# Altium schematic sheet Fuente3.3VDC.SchDoc
size A4; SheetNumber: 4; SheetTotal: 10
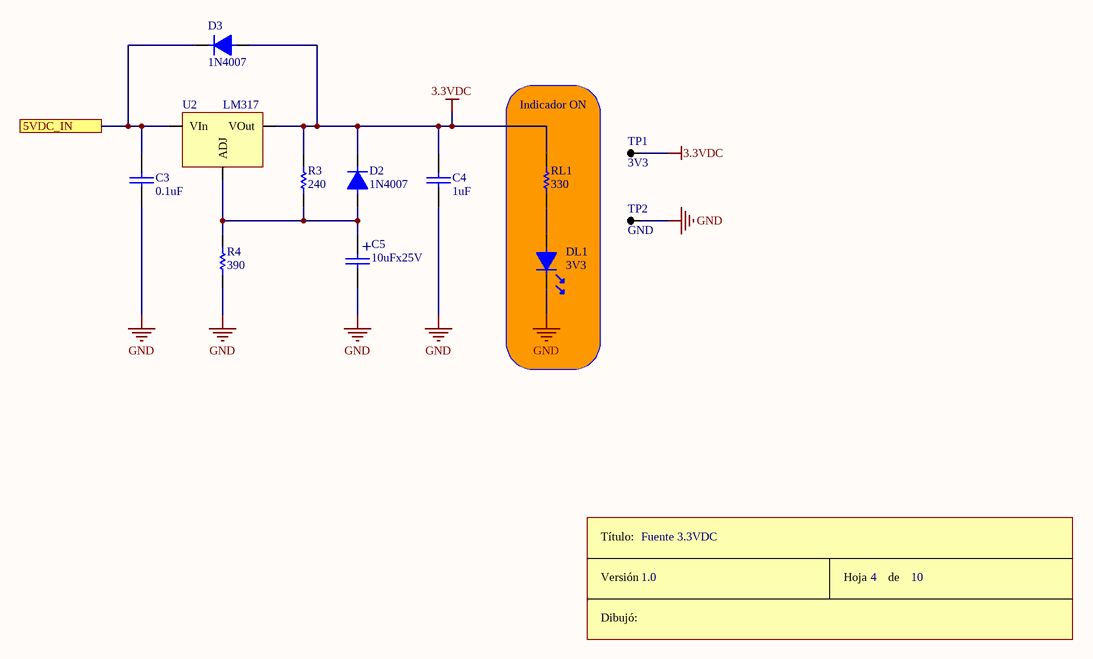
[diagram p0: Fuente3.3VDC.SchDoc]

## Parts
C3  0.1uF  [CAP100]
C4  1uF  [CAP200]
C5  10uFx25V  [CAP100RP]
D2  1N4007  [DO41]
D3  1N4007  [DO41]
DL1  3V3  [LED3]
R3  240  [RES400]
R4  390  [RES400]
RL1  330  [RES300]
ROT2  Rótulo  (value not drawn)  (graphical)
TP1  3V3  [TPTH]
TP2  GND  [TPTH]
U2  LM317  [TO-220 H]

## Blocks framed on the sheet
Indicador ON: DL1 RL1

## Ports
5VDC_IN

## Nets
3.3VDC: C4.1 D2.2 D3.1 R3.2 RL1.2 TP1.1 U2.2(VOut)
GND: C3.2 C4.2 C5.2 DL1.2 R4.1 TP2.1
5VDC_IN: C3.1 D3.2 U2.3(VIn) ; port 5VDC_IN
NetC5_1: C5.1 D2.1 R3.1 R4.2 U2.1(ADJ)
NetDL1_1: DL1.1 RL1.1

## Notes on the sheet
- Fuente 3.3VDC
- 1.0
- 4
- 10
- (in symbol CAPPOL) +
- (in symbol Rótulo) Título:; Versión; Hoja       de; Dibujó:

## Library data of the parts
C3 C4 = CAP
C5 = CAPPOL
D2 D3 = DIODO
DL1 = LED
R3 R4 RL1 = RES
TP1 TP2 = TP
U2 = LM317: IC REG ADJ 1.5A 3 TERM TO-220